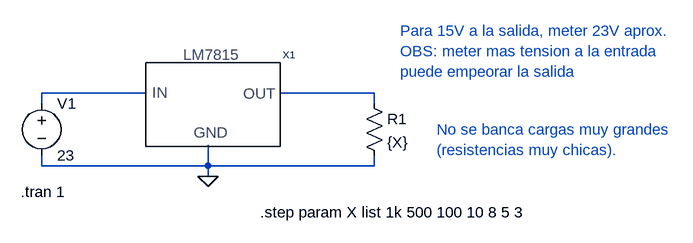
[diagram p0: schematic pruebaMiLM7815.asc]
pruebaMiLM7815.asc, the LTspice schematic file:
Version 4
SHEET 1 924 680
WIRE 96 144 -64 144
WIRE 448 144 304 144
WIRE -64 160 -64 144
WIRE 448 160 448 144
WIRE -64 256 -64 240
WIRE 192 256 192 224
WIRE 192 256 -64 256
WIRE 448 256 448 240
WIRE 448 256 192 256
WIRE 192 272 192 256
FLAG 192 272 0
SYMBOL LM7815 176 128 R0
SYMATTR InstName X1
SYMBOL voltage -64 144 R0
WINDOW 123 0 0 Left 0
WINDOW 39 0 0 Left 0
SYMATTR InstName V1
SYMATTR Value 23
SYMBOL res 432 144 R0
SYMATTR InstName R1
SYMATTR Value {X}
TEXT -96 296 Left 2 !.tran 1
TEXT 488 48 Left 2 ;Para 15V a la salida, meter 23V aprox.\nOBS: meter mas tension a la entrada\npuede empeorar la salida
TEXT 272 328 Left 2 !.step param X list 1k 500 100 10 8 5 3
TEXT 544 200 Left 2 ;No se banca cargas muy grandes\n(resistencias muy chicas).

The netlist it stands for:
* pruebaMiLM7815.asc
XX1 N001 N002 0 LM7815  ; pins IN OUT Ground
V1 N001 0 23
R1 N002 0 {X}
.tran 1
* Para 15V a la salida, meter 23V aprox.
* OBS: meter mas tension a la entrada
* puede empeorar la salida
.step param X list 1k 500 100 10 8 5 3
* No se banca cargas muy grandes
* (resistencias muy chicas).
.backanno
.end